# Altium project XM-JLINK-V1.0.0.PrjPcb
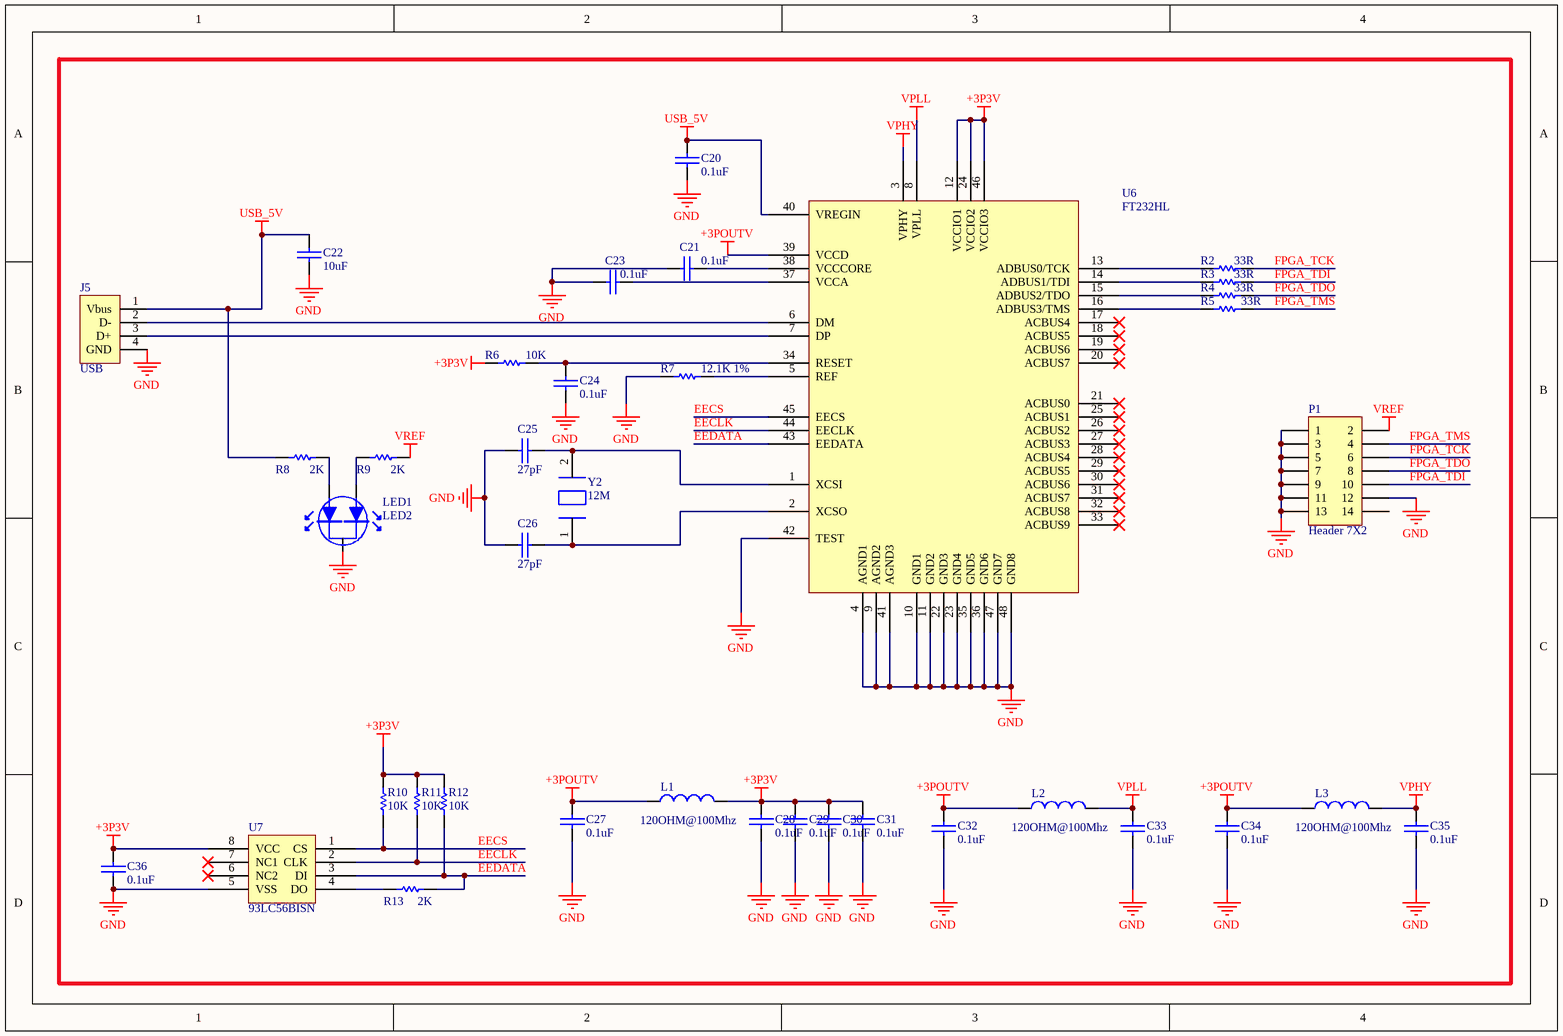
[diagram p0: XM-JLINK-V1.0.0.SchDoc]
1 sheet, 38 parts. Net scope: global (net labels, ports and power ports of the same name join across sheets).
Board file: XM-JLINK-V1.0.0.PcbDoc

## Sheet XM-JLINK-V1.0.0.SchDoc
size A4

### Parts
C20  0.1uF  [LC-0603_C]
C21  0.1uF  [LC-0603_C]
C22  10uF  [C1206]
C23  0.1uF  [LC-0603_C]
C24  0.1uF  [LC-0603_C]
C25  27pF  [LC-0603_C]
C26  27pF  [LC-0603_C]
C27  0.1uF  [LC-0603_C]
C28  0.1uF  [LC-0603_C]
C29  0.1uF  [LC-0603_C]
C30  0.1uF  [LC-0603_C]
C31  0.1uF  [LC-0603_C]
C32  0.1uF  [LC-0603_C]
C33  0.1uF  [LC-0603_C]
C34  0.1uF  [LC-0603_C]
C35  0.1uF  [LC-0603_C]
C36  0.1uF  [LC-0603_C]
J5  USB  [USB-B]
L1  120OHM@100Mhz  [LC-0603_L]
L2  120OHM@100Mhz  [LC-0603_L]
L3  120OHM@100Mhz  [LC-0603_L]
LED1  LED2  [HDR1X3]
P1  Header 7X2  [HDR2X14]
R2  value 33R  [LC-0603_R]  (hidden comment: Res1)
R3  value 33R  [LC-0603_R]  (hidden comment: Res1)
R4  value 33R  [LC-0603_R]  (hidden comment: Res1)
R5  value 33R  [LC-0603_R]  (hidden comment: Res1)
R6  value 10K  [LC-0603_R]  (hidden comment: Res1)
R7  value 12.1K 1%  [LC-0603_R]  (hidden comment: Res1)
R8  value 2K  [LC-0603_R]  (hidden comment: Res1)
R9  value 2K  [LC-0603_R]  (hidden comment: Res1)
R10  value 10K  [LC-0603_R]  (hidden comment: Res1)
R11  value 10K  [LC-0603_R]  (hidden comment: Res1)
R12  value 10K  [LC-0603_R]  (hidden comment: Res1)
R13  value 2K  [LC-0603_L]  (hidden comment: Res1)
U6  FT232HL
U7  93LC56BISN  [LC-SOIC-8_150mil]
Y2  12M  [CRYSTAL]

### Nets
+3P3V: C28.1 C29.1 C30.1 C31.1 C36.1 L1.2 R6.1 R10.2 R11.2 R12.2 U6.12(VCCIO1) U6.24(VCCIO2) U6.46(VCCIO3) U7.8(VCC)
+3POUTV: C27.1 C32.1 C34.1 L1.1 L2.1 L3.1 U6.39(VCCD)
GND: C20.2 C21.2 C22.2 C23.2 C24.1 C25.1 C26.2 C27.2 C28.2 C29.2 C30.2 C31.2 C32.2 C33.2 C34.2 C35.2 C36.2 J5.4(GND) LED1.2 P1.1 P1.3 P1.5 P1.7 P1.9 P1.11 P1.12 P1.13 R7.1 U6.4(AGND1) U6.9(AGND2) U6.10(GND1) U6.11(GND2) U6.22(GND3) U6.23(GND4) U6.35(GND5) U6.36(GND6) U6.41(AGND3) U6.42(TEST) U6.47(GND7) U6.48(GND8) U7.5(VSS)
USB_5V: C20.1 C22.1 J5.1(Vbus) R8.2 U6.40(VREGIN)
VPHY: C35.1 L3.2 U6.3(VPHY)
VPLL: C33.1 L2.2 U6.8(VPLL)
VREF: P1.2 R9.1
EECLK: R11.1 U6.44(EECLK) U7.2(CLK)
EECS: R10.1 U6.45(EECS) U7.1(CS)
EEDATA: R12.1 R13.1 U6.43(EEDATA) U7.3(DI)
FPGA_TCK: P1.6 R2.2
FPGA_TDI: P1.10 R3.2
FPGA_TDO: P1.8 R4.2
FPGA_TMS: P1.4 R5.2
NetC21_1: C21.1 U6.38(VCCCORE)
NetC23_1: C23.1 U6.37(VCCA)
NetC24_2: C24.2 R6.2 U6.34(RESET)
NetC25_2: C25.2 U6.1(XCSI) Y2.2
NetC26_1: C26.1 U6.2(XCSO) Y2.1
NetJ5_2: J5.2(D-) U6.6(DM)
NetJ5_3: J5.3(D+) U6.7(DP)
NetLED1_1: LED1.1 R8.1
NetLED1_3: LED1.3 R9.2
NetR2_1: R2.1 U6.13(ADBUS0/TCK)
NetR3_1: R3.1 U6.14(ADBUS1/TDI)
NetR4_1: R4.1 U6.15(ADBUS2/TDO)
NetR5_1: R5.1 U6.16(ADBUS3/TMS)
NetR7_2: R7.2 U6.5(REF)
NetR13_2: R13.2 U7.4(DO)

Not connected (* = marked no-connect by the designer): P1 14; U6 17(ACBUS4)* 18(ACBUS5)* 19(ACBUS6)* 20(ACBUS7)* 21(ACBUS0)* 25(ACBUS1)* 26(ACBUS2)* 27(ACBUS3)* 28(ACBUS4)* 29(ACBUS5)* 30(ACBUS6)* 31(ACBUS7)* 32(ACBUS8)* 33(ACBUS9)*; U7 6(NC2)* 7(NC1)*

### Library data of the parts
C20-C36 = CAP: Capacitor
J5 = Header 4: Header, 4-Pin; LatestRevisionDate: 17-Jul-2002; LatestRevisionNote: Re-released for DXP Platform.; Publisher: Altium Limited
L1-L3 = Inductor: Code_IEC: 1005; Published: 8-Jun-2000; LatestRevisionDate: 29-May-2009; LatestRevisionNote: IPC-7351 Footprint Added.; PackageReference: 0402-A; Publisher: Altium Limited; PackageDescription: Chip Inductor; Code_JEITA: 0402
P1 = Header 7X2: Header, 7-Pin, Dual row; LatestRevisionDate: 17-Jul-2002; LatestRevisionNote: Re-released for DXP Platform.; Publisher: Altium Limited
R2-R13 = Res1: Resistor; Published: 8-Jun-2000; LatestRevisionDate: 17-Jul-2002; LatestRevisionNote: Re-released for DXP Platform.; PackageReference: AXIAL-0.3; Publisher: Altium Limited; PackageDescription: Axial Device, Thru-Hole; 2 Leads; 0.3 in Pin Spacing
Y2 = XTAL